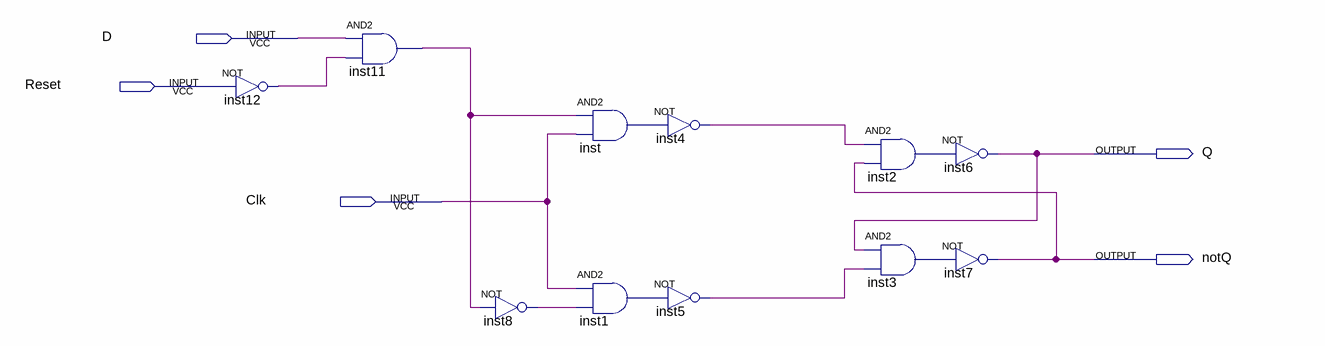
[diagram p0: schematic sheet]
// Quartus schematic Resttaable_D_Flip_Flop.bdf as structural Verilog: 11 symbols, 5 pins
module Resttaable_D_Flip_Flop (
  input  D,
  input  Reset,
  input  Clk,
  output Q,
  output notQ
);

  wire inst1_out, inst2_out, inst3_out, inst4_out, inst5_out, inst8_out, inst11_out, inst12_out, inst_out;

  not inst12 (inst12_out, Reset);
  and inst11 (inst11_out, D, inst12_out);
  not inst8 (inst8_out, inst11_out);
  and inst (inst_out, inst11_out, Clk);
  and inst1 (inst1_out, Clk, inst8_out);
  not inst4 (inst4_out, inst_out);
  not inst5 (inst5_out, inst1_out);
  and inst2 (inst2_out, inst4_out, notQ);
  and inst3 (inst3_out, Q, inst5_out);
  not inst6 (Q, inst2_out);
  not inst7 (notQ, inst3_out);
endmodule
